# EAGLE schematic light cube (EAGLE 6.5.0)
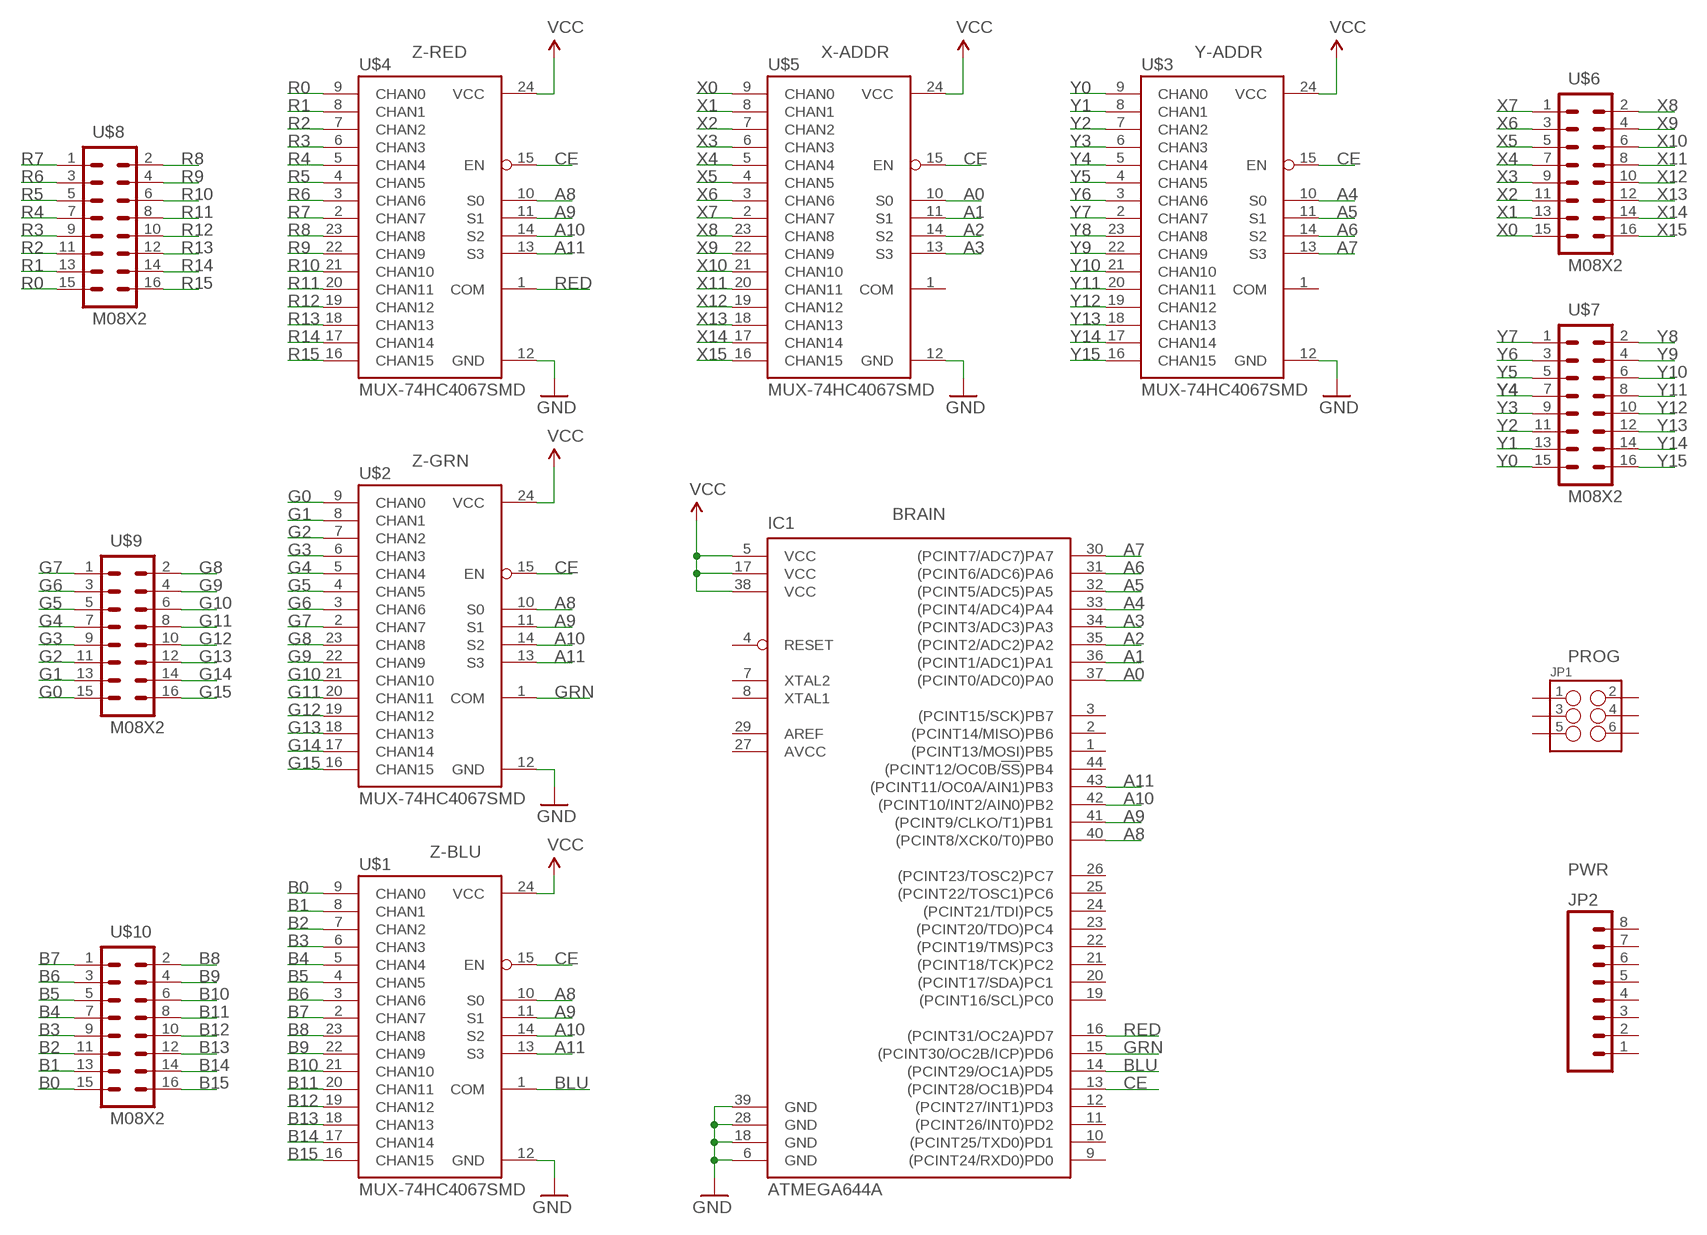
[diagram p0: schematic, sheet 1]

## Parts
IC1  ATMEGA644A  [TQFP44]
JP1  M03X2NO_SILK  [2X3-NS]
JP2  M081X08  [1X08]
U$1  MUX-74HC4067SMD  [SSOP24]
U$2  MUX-74HC4067SMD  [SSOP24]
U$3  MUX-74HC4067SMD  [SSOP24]
U$4  MUX-74HC4067SMD  [SSOP24]
U$5  MUX-74HC4067SMD  [SSOP24]
U$6  M08X2  [2X8]
U$7  M08X2  [2X8]
U$8  M08X2  [2X8]
U$9  M08X2  [2X8]
U$10  M08X2  [2X8]

## Nets
A0: IC1.37((PCINT0/ADC0)PA0) U$5.10(S0)
A1: IC1.36((PCINT1/ADC1)PA1) U$5.11(S1)
A2: IC1.35((PCINT2/ADC2)PA2) U$5.14(S2)
A3: IC1.34((PCINT3/ADC3)PA3) U$5.13(S3)
A4: IC1.33((PCINT4/ADC4)PA4) U$3.10(S0)
A5: IC1.32((PCINT5/ADC5)PA5) U$3.11(S1)
A6: IC1.31((PCINT6/ADC6)PA6) U$3.14(S2)
A7: IC1.30((PCINT7/ADC7)PA7) U$3.13(S3)
A8: IC1.40((PCINT8/XCK0/T0)PB0) U$1.10(S0) U$2.10(S0) U$4.10(S0)
A9: IC1.41((PCINT9/CLKO/T1)PB1) U$1.11(S1) U$2.11(S1) U$4.11(S1)
A10: IC1.42((PCINT10/INT2/AIN0)PB2) U$1.14(S2) U$2.14(S2) U$4.14(S2)
A11: IC1.43((PCINT11/OC0A/AIN1)PB3) U$1.13(S3) U$2.13(S3) U$4.13(S3)
B0: U$1.9(CHAN0) U$10.15
B1: U$1.8(CHAN1) U$10.13
B2: U$1.7(CHAN2) U$10.11
B3: U$1.6(CHAN3) U$10.9
B4: U$1.5(CHAN4) U$10.7
B5: U$1.4(CHAN5) U$10.5
B6: U$1.3(CHAN6) U$10.3
B7: U$1.2(CHAN7) U$10.1
B8: U$1.23(CHAN8) U$10.2
B9: U$1.22(CHAN9) U$10.4
B10: U$1.21(CHAN10) U$10.6
B11: U$1.20(CHAN11) U$10.8
B12: U$1.19(CHAN12) U$10.10
B13: U$1.18(CHAN13) U$10.12
B14: U$1.17(CHAN14) U$10.14
B15: U$1.16(CHAN15) U$10.16
BLU: IC1.14((PCINT29/OC1A)PD5) U$1.1(COM)
CE: IC1.13((PCINT28/OC1B)PD4) U$1.15(EN) U$2.15(EN) U$3.15(EN) U$4.15(EN) U$5.15(EN)
G0: U$2.9(CHAN0) U$9.15
G1: U$2.8(CHAN1) U$9.13
G2: U$2.7(CHAN2) U$9.11
G3: U$2.6(CHAN3) U$9.9
G4: U$2.5(CHAN4) U$9.7
G5: U$2.4(CHAN5) U$9.5
G6: U$2.3(CHAN6) U$9.3
G7: U$2.2(CHAN7) U$9.1
G8: U$2.23(CHAN8) U$9.2
G9: U$2.22(CHAN9) U$9.4
G10: U$2.21(CHAN10) U$9.6
G11: U$2.20(CHAN11) U$9.8
G12: U$2.19(CHAN12) U$9.10
G13: U$2.18(CHAN13) U$9.12
G14: U$2.17(CHAN14) U$9.14
G15: U$2.16(CHAN15) U$9.16
GND: IC1.6(GND) IC1.18(GND) IC1.28(GND) IC1.39(GND) U$1.12(GND) U$2.12(GND) U$3.12(GND) U$4.12(GND) U$5.12(GND)
GRN: IC1.15((PCINT30/OC2B/ICP)PD6) U$2.1(COM)
R0: U$4.9(CHAN0) U$8.15
R1: U$4.8(CHAN1) U$8.13
R2: U$4.7(CHAN2) U$8.11
R3: U$4.6(CHAN3) U$8.9
R4: U$4.5(CHAN4) U$8.7
R5: U$4.4(CHAN5) U$8.5
R6: U$4.3(CHAN6) U$8.3
R7: U$4.2(CHAN7) U$8.1
R8: U$4.23(CHAN8) U$8.2
R9: U$4.22(CHAN9) U$8.4
R10: U$4.21(CHAN10) U$8.6
R11: U$4.20(CHAN11) U$8.8
R12: U$4.19(CHAN12) U$8.10
R13: U$4.18(CHAN13) U$8.12
R14: U$4.17(CHAN14) U$8.14
R15: U$4.16(CHAN15) U$8.16
RED: IC1.16((PCINT31/OC2A)PD7) U$4.1(COM)
VCC: IC1.5(VCC) IC1.17(VCC) IC1.38(VCC) U$1.24(VCC) U$2.24(VCC) U$3.24(VCC) U$4.24(VCC) U$5.24(VCC)
X0: U$5.9(CHAN0) U$6.15
X1: U$5.8(CHAN1) U$6.13
X2: U$5.7(CHAN2) U$6.11
X3: U$5.6(CHAN3) U$6.9
X4: U$5.5(CHAN4) U$6.7
X5: U$5.4(CHAN5) U$6.5
X6: U$5.3(CHAN6) U$6.3
X7: U$5.2(CHAN7) U$6.1
X8: U$5.23(CHAN8) U$6.2
X9: U$5.22(CHAN9) U$6.4
X10: U$5.21(CHAN10) U$6.6
X11: U$5.20(CHAN11) U$6.8
X12: U$5.19(CHAN12) U$6.10
X13: U$5.18(CHAN13) U$6.12
X14: U$5.17(CHAN14) U$6.14
X15: U$5.16(CHAN15) U$6.16
Y0: U$3.9(CHAN0) U$7.15
Y1: U$3.8(CHAN1) U$7.13
Y2: U$3.7(CHAN2) U$7.11
Y3: U$3.6(CHAN3) U$7.9
Y4: U$3.5(CHAN4) U$7.7
Y5: U$3.4(CHAN5) U$7.5
Y6: U$3.3(CHAN6) U$7.3
Y7: U$3.2(CHAN7) U$7.1
Y8: U$3.23(CHAN8) U$7.2
Y9: U$3.22(CHAN9) U$7.4
Y10: U$3.21(CHAN10) U$7.6
Y11: U$3.20(CHAN11) U$7.8
Y12: U$3.19(CHAN12) U$7.10
Y13: U$3.18(CHAN13) U$7.12
Y14: U$3.17(CHAN14) U$7.14
Y15: U$3.16(CHAN15) U$7.16
Unconnected: IC1.1((PCINT13/MOSI)PB5) IC1.2((PCINT14/MISO)PB6) IC1.3((PCINT15/SCK)PB7) IC1.4(RESET) IC1.7(XTAL2) IC1.8(XTAL1) IC1.9((PCINT24/RXD0)PD0) IC1.10((PCINT25/TXD0)PD1) IC1.11((PCINT26/INT0)PD2) IC1.12((PCINT27/INT1)PD3) IC1.19((PCINT16/SCL)PC0) IC1.20((PCINT17/SDA)PC1) IC1.21((PCINT18/TCK)PC2) IC1.22((PCINT19/TMS)PC3) IC1.23((PCINT20/TDO)PC4) IC1.24((PCINT21/TDI)PC5) IC1.25((PCINT22/TOSC1)PC6) IC1.26((PCINT23/TOSC2)PC7) IC1.29(AREF) IC1.44((PCINT12/OC0B/!SS!)PB4) JP1.1 JP1.2 JP1.3 JP1.4 JP1.5 JP1.6 JP2.1 JP2.2 JP2.3 JP2.4 JP2.5 JP2.6 JP2.7 JP2.8 U$3.1(COM) U$5.1(COM)

## Notes on the sheet
- Z-RED | X-ADDR | Y-ADDR
- Z-GRN
- BRAIN
- PROG
- Z-BLU
- PWR

## Power pins joined to a net without a drawn wire
AVCC: IC1.27(AVCC)

## Library data of the parts
IC1 = atmel:ATMEGA644: 8-bit Microcontroller with 64K Bytes In-System Programmable Flash Source: http://www.atmel.com/dyn/resources/prod_documents/doc2593.pdf; MPN: ATMEGA644PV-10AU; OC_FARNELL: 1455123; OC_NEWARK: 58M3748
JP1 = SparkFun-Connectors:M03X2: 2x3 .1" header. Shrouded, with keying- CONN-10681 SMT- CONN-11415 Pogo pins- HW-11044
JP2 = SparkFun-Connectors:M08: Header 8 Standard 8-pin 0.1" header. Use with straight break away headers (SKU : PRT-00116), right angle break away headers (PRT-00553), swiss pins (PRT-00743), machine pins (PRT-00117), and female headers (PRT-00115).
U$1-U$5 = SparkFun-AnalogIC:MUX-74HC4067: 16-channel analog MUX
U$6-U$10 = SparkFun-Connectors:M08X2: .1" headers, two rows of 8 each